# EasyEDA schematic EASYEADA_SCH_WaterLevelAtmega328_2022-11-24.json
TITLE: Sheet_1; REV: 1.0; Date: 2022-09-16; Sheet: 1/1; Drawn By: COB RCE; Company: Your Company
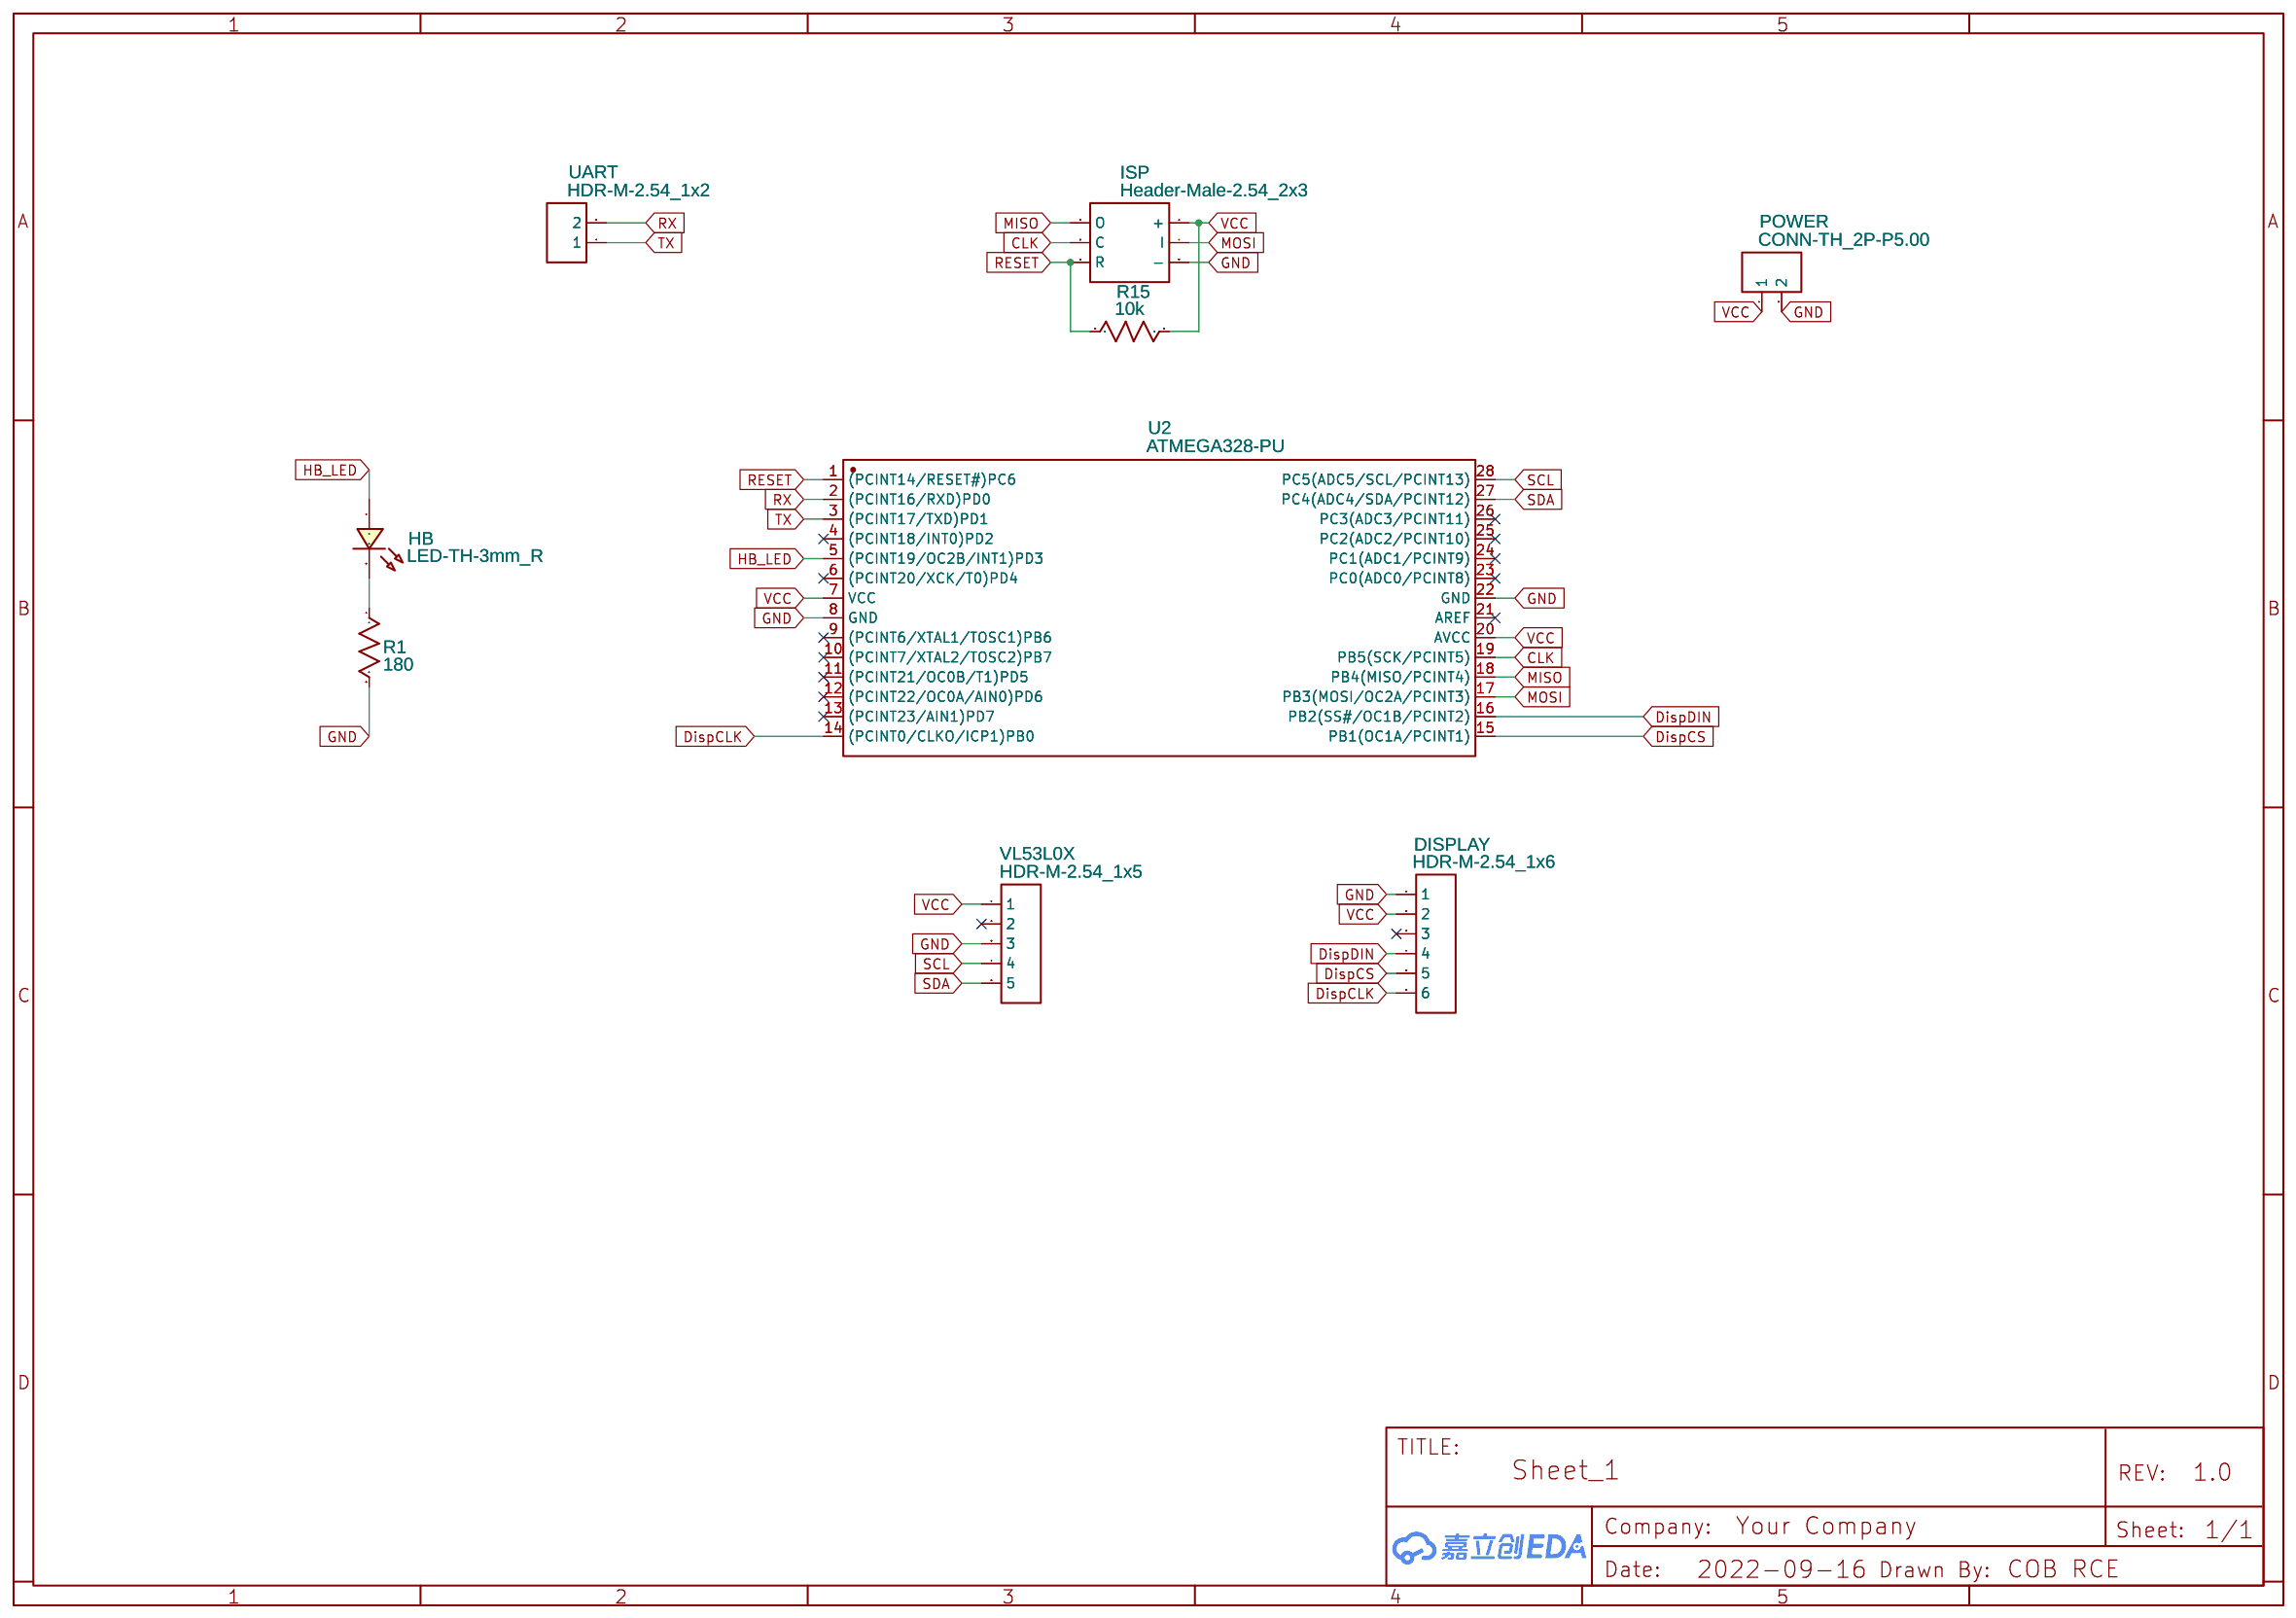
[diagram p0: schematic sheet]

## Parts
DISPLAY  HDR-M-2.54_1x6  [HDR-M-2.54_1X6]
HB  LED-TH-3mm_R  [LED-TH_BD3.0_RED]
ISP  Header-Male-2.54_2x3  [HDR-TH_6PIN-V-ROW2-COL3-MALE-PITCH2.54]
POWER  CONN-TH_2P-P5.00  [CONN-TH_2P-P5.00]
R1  180  [AXIAL-0.3]
R15  10k  [AXIAL-0.3]
U2  ATMEGA328-PU  [DIP-28_L35.0-W6.5-P2.54-LS7.6-BL]
UART  HDR-M-2.54_1x2  [HDR-M-2.54_1X2]
VL53L0X  HDR-M-2.54_1x5  [HDR-M-2.54_1X5]

## Library data of the parts
DISPLAY = HDR-M-2.54_1x6: Supplier Part: C190819; Supplier: LCSC; Contributor: LCEDA_Lib
HB = LED-TH-3mm_R: Manufacturer: EVERLIGHT(台湾亿光); Manufacturer Part: 204-10SDRD/S530-A3-L; Supplier Part: C84774; Supplier: LCSC; Contributor: LCEDA_Lib
ISP = -: Supplier: LCSC; Manufacturer: BOOMELE; Supplier Part: C65114
POWER = CONN-TH_2P-P5.00: Supplier: LCSC; Contributor: LCEDA_Lib
R1 R15 = Res_AXIAL-0.3(1/8W)_US: Manufacturer Part: ?
U2 = ATMEGA328-PU: Supplier: LCSC; Supplier Part: C613508; Manufacturer: MICROCHIP(美国微芯); Contributor: LCSC; JLCPCB Part Class: Extended Part
UART = HDR-M-2.54_1x2: Supplier Part: C124375; Supplier: LCSC; Contributor: LCEDA_Lib
VL53L0X = HDR-M-2.54_1x5: Supplier Part: C358687; Supplier: LCSC; Contributor: LCEDA_Lib

## Nets
GND: DISPLAY.1 ISP.6(-) POWER.2 R1.2 U2.8(GND) U2.22(GND) VL53L0X.3
VCC: DISPLAY.2 ISP.2(+) POWER.1 R15.2 U2.7(VCC) U2.20(AVCC) VL53L0X.1
CLK: ISP.3(C) U2.19(PB5(SCK/PCINT5))
DispCLK: DISPLAY.6 U2.14((PCINT0/CLKO/ICP1)PB0)
DispCS: DISPLAY.5 U2.15(PB1(OC1A/PCINT1))
DispDIN: DISPLAY.4 U2.16(PB2(SS#/OC1B/PCINT2))
HB_LED: HB.1 U2.5((PCINT19/OC2B/INT1)PD3)
MISO: ISP.1(O) U2.18(PB4(MISO/PCINT4))
MOSI: ISP.4(I) U2.17(PB3(MOSI/OC2A/PCINT3))
RESET: ISP.5(R) R15.1 U2.1((PCINT14/RESET#)PC6)
RX: U2.2((PCINT16/RXD)PD0) UART.2
SCL: U2.28(PC5(ADC5/SCL/PCINT13)) VL53L0X.4
SDA: U2.27(PC4(ADC4/SDA/PCINT12)) VL53L0X.5
TX: U2.3((PCINT17/TXD)PD1) UART.1
Net-(HB-2): HB.2 R1.1

Not connected (* = marked no-connect by the designer): DISPLAY 3*; U2 4((PCINT18/INT0)PD2)* 6((PCINT20/XCK/T0)PD4)* 9((PCINT6/XTAL1/TOSC1)PB6)* 10((PCINT7/XTAL2/TOSC2)PB7)* 11((PCINT21/OC0B/T1)PD5)* 12((PCINT22/OC0A/AIN0)PD6)* 13((PCINT23/AIN1)PD7)* 21(AREF)* 23(PC0(ADC0/PCINT8))* 24(PC1(ADC1/PCINT9))* 25(PC2(ADC2/PCINT10))* 26(PC3(ADC3/PCINT11))*; VL53L0X 2*
